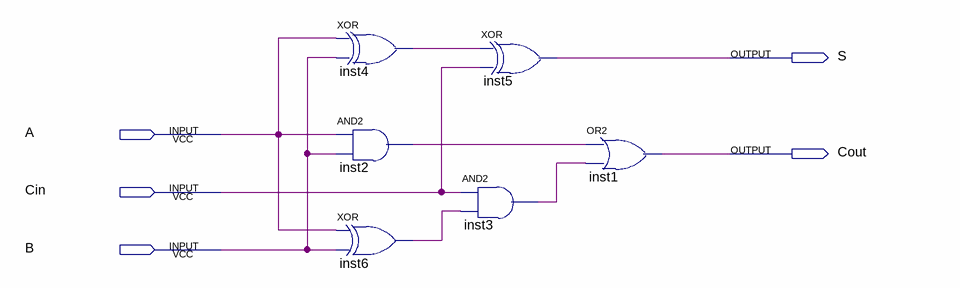
[diagram p0: schematic sheet]
// Quartus schematic Fulladder.bdf as structural Verilog: 6 symbols, 5 pins
module Fulladder (
  input  A,
  input  Cin,
  input  B,
  output S,
  output Cout
);

  wire inst2_out, inst3_out, inst4_out, inst6_out;

  xor inst4 (inst4_out, A, B);
  and inst2 (inst2_out, A, B);
  xor inst6 (inst6_out, A, B);
  xor inst5 (S, inst4_out, Cin);
  and inst3 (inst3_out, Cin, inst6_out);
  or inst1 (Cout, inst2_out, inst3_out);
endmodule
